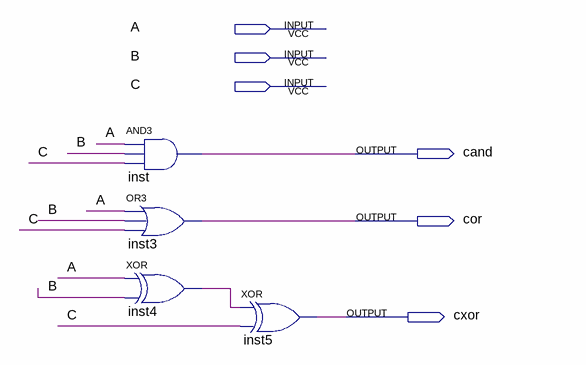
[diagram p0: schematic sheet]
// Quartus schematic s11_sksl.bdf as structural Verilog: 4 symbols, 6 pins
module s11_sksl (
  input  A,
  input  B,
  input  C,
  output cand,
  output cor,
  output cxor
);

  wire inst4_out;

  and inst (cand, A, B, C);
  or inst3 (cor, A, B, C);
  xor inst4 (inst4_out, A, B);
  xor inst5 (cxor, inst4_out, C);
endmodule
